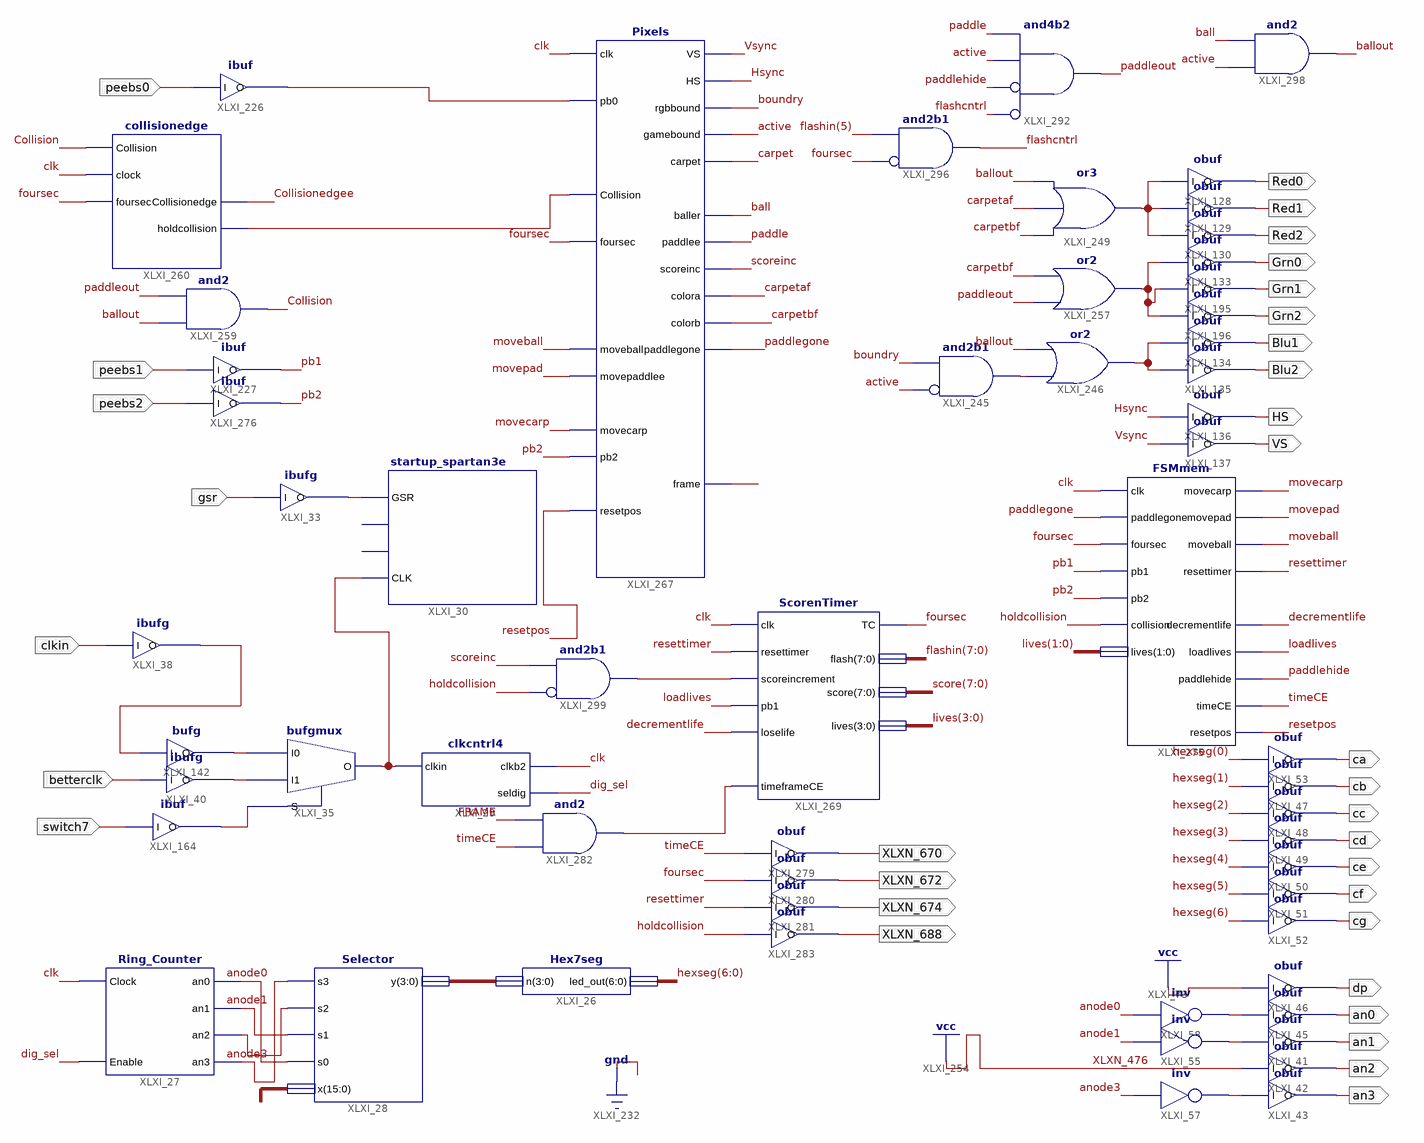
[diagram p0: schematic sheet 1]
// Xilinx ISE schematic Top.sch (spartan3e) as structural Verilog: 57 symbols, 33 ports
module Top (
  input  gsr,
  input  betterclk,
  input  clkin,
  input  switch7,
  input  peebs0,
  input  peebs1,
  input  peebs2,
  output an0,
  output dp,
  output an3,
  output an2,
  output an1,
  output ca,
  output cb,
  output cc,
  output cd,
  output ce,
  output cf,
  output cg,
  output HS,
  output VS,
  output Blu1,
  output Blu2,
  output Grn2,
  output Grn1,
  output Grn0,
  output Red2,
  output Red1,
  output Red0,
  output XLXN_670,
  output XLXN_672,
  output XLXN_674,
  output XLXN_688
);

  wire active, anode0, anode1, anode3, ball, ballout, boundry, carpet, carpetaf, carpetbf, clk, Collision,
       Collisionedgee, decrementlife, dig_sel, flashcntrl, foursec, FRAME, holdcollision, Hsync, loadlives,
       moveball, movecarp, movepad, paddle, paddlegone, paddlehide, paddleout, pb1, pb2, resetpos,
       resettimer, scoreinc, sw7, timeCE, Vsync, XLXN_56, XLXN_71, XLXN_75, XLXN_84, XLXN_86, XLXN_87,
       XLXN_242, XLXN_243, XLXN_472, XLXN_542, XLXN_570, XLXN_572, XLXN_574, XLXN_616, XLXN_676, XLXN_739;
  wire [3:0] lives, XLXN_82;
  wire [6:0] hexseg;
  wire [7:0] flashin, score;

  clkcntrl4 XLXI_29 (.clkin(XLXN_75), .clkb2(clk), .seldig(dig_sel));
  startup_spartan3e XLXI_30 (.CLK(XLXN_75), .GSR(XLXN_56));  // open: GTS, MBT
  ibufg XLXI_33 (.I(gsr), .O(XLXN_56));
  bufgmux XLXI_35 (.I0(XLXN_242), .I1(XLXN_71), .S(sw7), .O(XLXN_75));
  ibufg XLXI_40 (.I(betterclk), .O(XLXN_71));
  not XLXI_58 (XLXN_87, anode0);
  obuf XLXI_45 (.I(XLXN_87), .O(an0));
  obuf XLXI_46 (.I(1'b1), .O(dp));
  not XLXI_57 (XLXN_86, anode3);
  not XLXI_55 (XLXN_84, anode1);
  obuf XLXI_43 (.I(XLXN_86), .O(an3));
  obuf XLXI_42 (.I(1'b1), .O(an2));
  obuf XLXI_41 (.I(XLXN_84), .O(an1));
  obuf XLXI_47 (.I(hexseg[1]), .O(cb));
  obuf XLXI_48 (.I(hexseg[2]), .O(cc));
  obuf XLXI_49 (.I(hexseg[3]), .O(cd));
  obuf XLXI_50 (.I(hexseg[4]), .O(ce));
  obuf XLXI_51 (.I(hexseg[5]), .O(cf));
  obuf XLXI_52 (.I(hexseg[6]), .O(cg));
  obuf XLXI_53 (.I(hexseg[0]), .O(ca));
  obuf XLXI_136 (.I(Hsync), .O(HS));
  obuf XLXI_137 (.I(Vsync), .O(VS));
  ibufg XLXI_38 (.I(clkin), .O(XLXN_243));
  bufg XLXI_142 (.I(XLXN_243), .O(XLXN_242));
  ibuf XLXI_164 (.I(switch7), .O(sw7));
  Ring_Counter XLXI_27 (.Clock(clk), .Enable(dig_sel), .an0(anode0), .an1(anode1), .an2(XLXN_472), .an3(anode3));
  obuf XLXI_134 (.I(XLXN_574), .O(Blu1));
  obuf XLXI_130 (.I(XLXN_570), .O(Red2));
  obuf XLXI_129 (.I(XLXN_570), .O(Red1));
  obuf XLXI_128 (.I(XLXN_570), .O(Red0));
  obuf XLXI_135 (.I(XLXN_574), .O(Blu2));
  obuf XLXI_133 (.I(XLXN_572), .O(Grn0));
  obuf XLXI_195 (.I(XLXN_572), .O(Grn1));
  obuf XLXI_196 (.I(XLXN_572), .O(Grn2));
  ibuf XLXI_226 (.I(peebs0), .O(XLXN_616));
  ibuf XLXI_227 (.I(peebs1), .O(pb1));
  Selector XLXI_28 (.s3(anode3), .s2(XLXN_472), .s1(anode1), .s0(anode0), .x({lives, 4'b0000, score}), .y(XLXN_82));
  Hex7seg XLXI_26 (.n(XLXN_82), .led_out(hexseg));
  and XLXI_245 (XLXN_542, ~active, boundry);  // and2b1
  or XLXI_246 (XLXN_574, XLXN_542, ballout);
  or XLXI_249 (XLXN_570, carpetbf, carpetaf, ballout);
  or XLXI_257 (XLXN_572, paddleout, carpetbf);
  collisionedge XLXI_260 (
    .clock(clk), .foursec(foursec), .Collision(Collision), .Collisionedge(Collisionedgee),
    .holdcollision(holdcollision));
  Pixels XLXI_267 (
    .clk(clk), .pb0(XLXN_616), .pb2(pb2), .Collision(holdcollision), .foursec(foursec), .moveball(moveball),
    .movepaddlee(movepad), .movecarp(movecarp), .VS(Vsync), .frame(FRAME), .baller(ball), .paddlee(paddle),
    .scoreinc(scoreinc), .HS(Hsync), .rgbbound(boundry), .gamebound(active), .carpet(carpet),
    .colora(carpetaf), .colorb(carpetbf), .paddlegone(paddlegone), .resetpos(resetpos));
  ScorenTimer XLXI_269 (
    .clk(clk), .resettimer(resettimer), .scoreincrement(XLXN_739), .pb1(loadlives), .loselife(decrementlife),
    .TC(foursec), .flash(flashin), .score(score), .lives(lives), .timeframeCE(XLXN_676));
  and XLXI_259 (Collision, ballout, paddleout);
  ibuf XLXI_276 (.I(peebs2), .O(pb2));
  obuf XLXI_279 (.I(timeCE), .O(XLXN_670));
  obuf XLXI_280 (.I(foursec), .O(XLXN_672));
  obuf XLXI_281 (.I(resettimer), .O(XLXN_674));
  and XLXI_282 (XLXN_676, timeCE, FRAME);
  obuf XLXI_283 (.I(holdcollision), .O(XLXN_688));
  FSMmem XLXI_275 (
    .clk(clk), .lives(lives[1:0]), .pb1(pb1), .pb2(pb2), .foursec(foursec), .collision(holdcollision),
    .paddlegone(paddlegone), .movecarp(movecarp), .movepad(movepad), .moveball(moveball),
    .resettimer(resettimer), .decrementlife(decrementlife), .loadlives(loadlives), .paddlehide(paddlehide),
    .timeCE(timeCE), .resetpos(resetpos));
  and XLXI_292 (paddleout, ~flashcntrl, ~paddlehide, active, paddle);  // and4b2
  and XLXI_296 (flashcntrl, ~foursec, flashin[5]);  // and2b1
  and XLXI_298 (ballout, active, ball);
  and XLXI_299 (XLXN_739, ~holdcollision, scoreinc);  // and2b1

  // Notes on the sheet:
  //   LOC on signal gsr = A7
  //   LOC on signal betterclk = M6
  //   LOC on signal an0 = F12
  //   LOC on signal dp = N13
  //   LOC on signal an3 = K14
  //   LOC on signal an2 = M13
  //   LOC on signal an1 = J12
  //   LOC on signal ca = L14
  //   LOC on signal cb = H12
  //   LOC on signal cc = N14
  //   LOC on signal cd = N11
  //   LOC on signal ce = P12
  //   LOC on signal cf = L13
  //   LOC on signal cg = M12
  //   LOC on signal HS = J14
  //   LOC on signal VS = K13
  //   LOC on signal clkin = B8
  //   LOC on signal switch7 = N3
  //   LOC on signal Blu1 = H13
  //   LOC on signal Blu2 = J13
  //   LOC on signal Grn2 = G14
  //   LOC on signal Grn1 = G13
  //   LOC on signal Grn0 = F14
  //   LOC on signal Red2 = F13
  //   LOC on signal Red1 = D13
  //   LOC on signal Red0 = C14
  //   LOC on signal peebs0 = G12
  //   LOC on signal peebs1 = C11
  //   LOC on signal peebs2 = M4
  //   LOC on signal XLXN_670 = M5
  //   LOC on signal XLXN_672 = M11
  //   LOC on signal XLXN_674 = P7
  //   LOC on signal XLXN_688 = P6
endmodule
